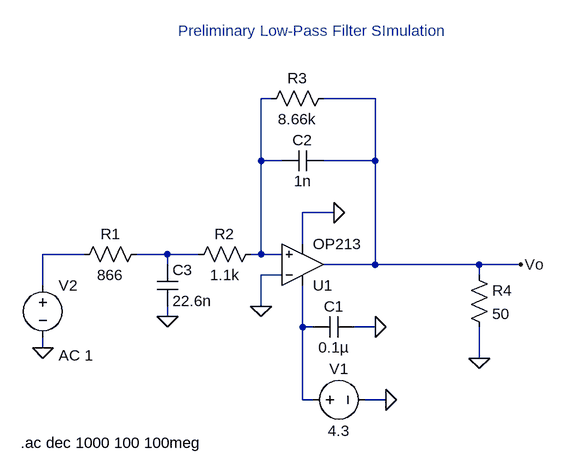
[diagram p0: schematic LowPassFilterSimulation_1.asc]
LowPassFilterSimulation_1.asc, the LTspice schematic file:
Version 4
SHEET 1 880 680
WIRE 144 -96 128 -96
WIRE 304 -96 224 -96
WIRE 128 0 128 -96
WIRE 160 0 128 0
WIRE 304 0 304 -96
WIRE 304 0 224 0
WIRE 240 80 192 80
WIRE 192 128 192 80
WIRE -144 144 -208 144
WIRE -16 144 -64 144
WIRE 32 144 -16 144
WIRE 128 144 128 0
WIRE 128 144 112 144
WIRE 160 144 128 144
WIRE -16 160 -16 144
WIRE 304 160 304 0
WIRE 304 160 224 160
WIRE 464 160 304 160
WIRE 528 160 464 160
WIRE 160 176 128 176
WIRE 464 176 464 160
WIRE -208 192 -208 144
WIRE 128 224 128 176
WIRE -16 240 -16 224
WIRE 192 256 192 192
WIRE 208 256 192 256
WIRE 304 256 272 256
WIRE -208 288 -208 272
WIRE 464 304 464 256
WIRE 192 368 192 256
WIRE 208 368 192 368
WIRE 320 368 288 368
FLAG 304 256 0
FLAG 320 368 0
FLAG 240 80 0
FLAG -16 240 0
FLAG 128 224 0
FLAG -208 288 0
FLAG 464 304 0
FLAG 528 160 Vo
SYMBOL Opamps\\OP213 192 224 M180
SYMATTR InstName U1
SYMBOL cap 272 240 R90
WINDOW 0 0 32 VBottom 2
WINDOW 3 32 32 VTop 2
SYMATTR InstName C1
SYMATTR Value 0.1µ
SYMBOL voltage 192 368 R270
WINDOW 0 32 56 VTop 2
WINDOW 3 -32 56 VBottom 2
WINDOW 123 0 0 Left 0
WINDOW 39 0 0 Left 0
SYMATTR InstName V1
SYMATTR Value 4.3
SYMBOL cap 224 -16 R90
WINDOW 0 0 32 VBottom 2
WINDOW 3 32 32 VTop 2
SYMATTR InstName C2
SYMATTR Value 1n
SYMBOL cap -32 160 R0
SYMATTR InstName C3
SYMATTR Value 22.6n
SYMBOL res -48 128 R90
WINDOW 0 0 56 VBottom 2
WINDOW 3 32 56 VTop 2
SYMATTR InstName R1
SYMATTR Value 866
SYMBOL res 128 128 R90
WINDOW 0 0 56 VBottom 2
WINDOW 3 32 56 VTop 2
SYMATTR InstName R2
SYMATTR Value 1.1k
SYMBOL res 240 -112 R90
WINDOW 0 0 56 VBottom 2
WINDOW 3 32 56 VTop 2
SYMATTR InstName R3
SYMATTR Value 8.66k
SYMBOL voltage -208 176 R0
WINDOW 123 24 124 Left 2
WINDOW 39 0 0 Left 0
SYMATTR InstName V2
SYMATTR Value ""
SYMATTR Value2 AC 1
SYMBOL res 448 160 R0
SYMATTR InstName R4
SYMATTR Value 50
TEXT -242 434 Left 2 !.ac dec 1000 100 100meg
TEXT 0 -200 Left 2 ;Preliminary Low-Pass Filter SImulation

The netlist it stands for:
* LowPassFilterSimulation_1.asc
XU1 N001 0 N004 0 Vo OP213  ; pins In+ In- V+ V- OUT
C1 0 N004 0.1µ
V1 N004 0 4.3
C2 Vo N001 1n
C3 N003 0 22.6n
R1 N003 N002 866
R2 N001 N003 1.1k
R3 Vo N001 8.66k
V2 N002 0 AC 1
R4 Vo 0 50
.ac dec 1000 100 100meg
* Preliminary Low-Pass Filter SImulation
.backanno
.end